# Altium schematic sheet Revision_History-1.SchDoc: Dahlia Carrier Board
size A3; Organization: Toradex AG; Address1: Ebenaustrasse 10; Address2: Horw; Address3: 6048; Address4: Switzerland; DocumentNumber: 2; Revision: V1.1; SheetNumber: 2; SheetTotal: 21; PageSetup: Record=PageOptions|CenterHorizontal=True|CenterVertical=True|PrintScale=0.73|XCorrection=1.00|YCorrection=1.00|PrintKind=0|BorderSize=5000000|LeftOffset=0|BottomOffset=0|Orientation=2|PaperLength=1000|PaperWidth=1000|Scale=100|PaperSource=7|PrintQuality=-4|MediaType=1|DitherType=10|PaperKind=A4|PrintScaleMode=1
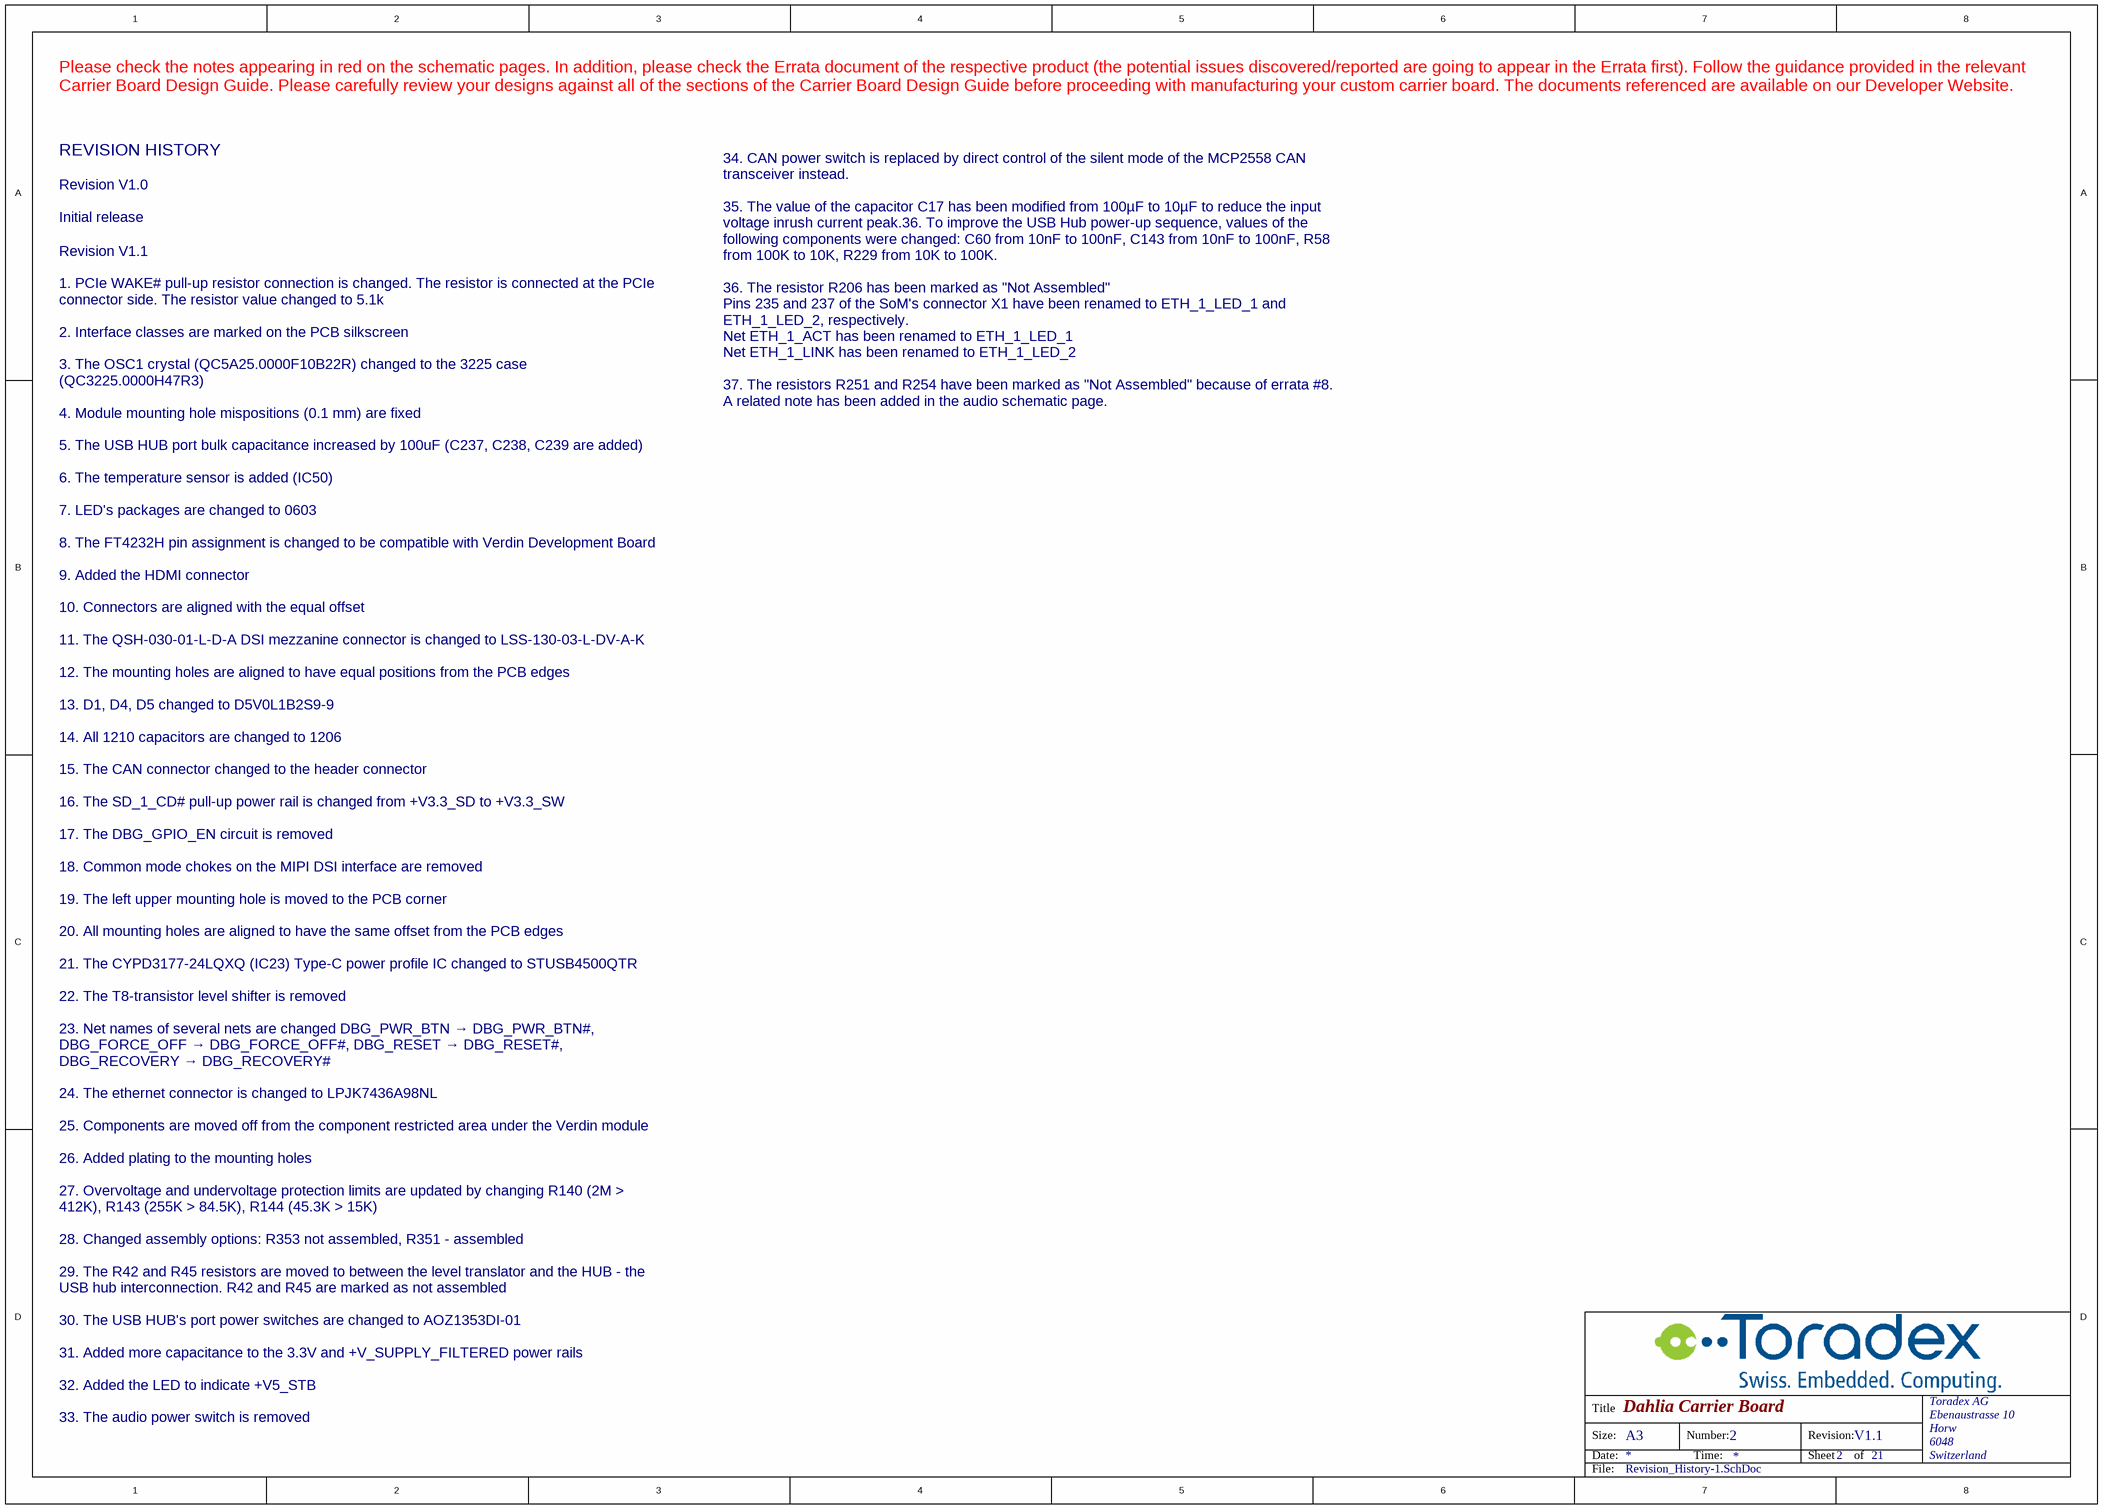
[diagram p0: Revision_History-1.SchDoc]

## Notes on the sheet
- Please check the notes appearing in red on the schematic pages. In addition, please check the Errata document of the respective product (the potential issues discovered/reported are going to appear in the Errata first). Follow the guidance provided in the relevant Carrier Board Design Guide. Please carefully review your designs against all of the sections of the Carrier Board Design Guide before proceeding with manufacturing your custom carrier board. The documents referenced are available on our Developer Website.
- REVISION HISTORY
- Revision V1.0
  Initial release
- 34. CAN power switch is replaced by direct control of the silent mode of the MCP2558 CAN transceiver instead.
  35. The value of the capacitor C17 has been modified from 100µF to 10µF to reduce the input voltage inrush current peak.36. To improve the USB Hub power-up sequence, values of the following components were changed: C60 from 10nF to 100nF, C143 from 10nF to 100nF, R58 from 100K to 10K, R229 from 10K to 100K.
  36. The resistor R206 has been marked as "Not Assembled"
  Pins 235 and 237 of the SoM's connector X1 have been renamed to ETH_1_LED_1 and ETH_1_LED_2, respectively.
  Net ETH_1_ACT has been renamed to ETH_1_LED_1
  Net ETH_1_LINK has been renamed to ETH_1_LED_2
  37. The resistors R251 and R254 have been marked as "Not Assembled" because of errata #8. A related note has been added in the audio schematic page.
- Revision V1.1
  1. PCIe WAKE# pull-up resistor connection is changed. The resistor is connected at the PCIe connector side. The resistor value changed to 5.1k
  2. Interface classes are marked on the PCB silkscreen
  3. The OSC1 crystal (QC5A25.0000F10B22R) changed to the 3225 case (QC3225.0000H47R3)
  4. Module mounting hole mispositions (0.1 mm) are fixed
  5. The USB HUB port bulk capacitance increased by 100uF (C237, C238, C239 are added)
  6. The temperature sensor is added (IC50)
  7. LED's packages are changed to 0603
  8. The FT4232H pin assignment is changed to be compatible with Verdin Development Board
  9. Added the HDMI connector
  10. Connectors are aligned with the equal offset
  11. The QSH-030-01-L-D-A DSI mezzanine connector is changed to LSS-130-03-L-DV-A-K
  12. The mounting holes are aligned to have equal positions from the PCB edges
  13. D1, D4, D5 changed to D5V0L1B2S9-9
  14. All 1210 capacitors are changed to 1206
  15. The CAN connector changed to the header connector
  16. The SD_1_CD# pull-up power rail is changed from +V3.3_SD to +V3.3_SW
  17. The DBG_GPIO_EN circuit is removed
  18. Common mode chokes on the MIPI DSI interface are removed
  19. The left upper mounting hole is moved to the PCB corner
  20. All mounting holes are aligned to have the same offset from the PCB edges
  21. The CYPD3177-24LQXQ (IC23) Type-C power profile IC changed to STUSB4500QTR
  22. The T8-transistor level shifter is removed
  23. Net names of several nets are changed DBG_PWR_BTN → DBG_PWR_BTN#, DBG_FORCE_OFF → DBG_FORCE_OFF#, DBG_RESET → DBG_RESET#, DBG_RECOVERY → DBG_RECOVERY#
  24. The ethernet connector is changed to LPJK7436A98NL
  25. Components are moved off from the component restricted area under the Verdin module
  26. Added plating to the mounting holes
  27. Overvoltage and undervoltage protection limits are updated by changing R140 (2M > 412K), R143 (255K > 84.5K), R144 (45.3K > 15K)
  28. Changed assembly options: R353 not assembled, R351 - assembled
  29. The R42 and R45 resistors are moved to between the level translator and the HUB - the USB hub interconnection. R42 and R45 are marked as not assembled
  30. The USB HUB's port power switches are changed to AOZ1353DI-01
  31. Added more capacitance to the 3.3V and +V_SUPPLY_FILTERED power rails
  32. Added the LED to indicate +V5_STB
  33. The audio power switch is removed
- Title
- Size:
- Date:
- A3
- Number:
- Time:
- Revision:
- Sheet
- of
- File: